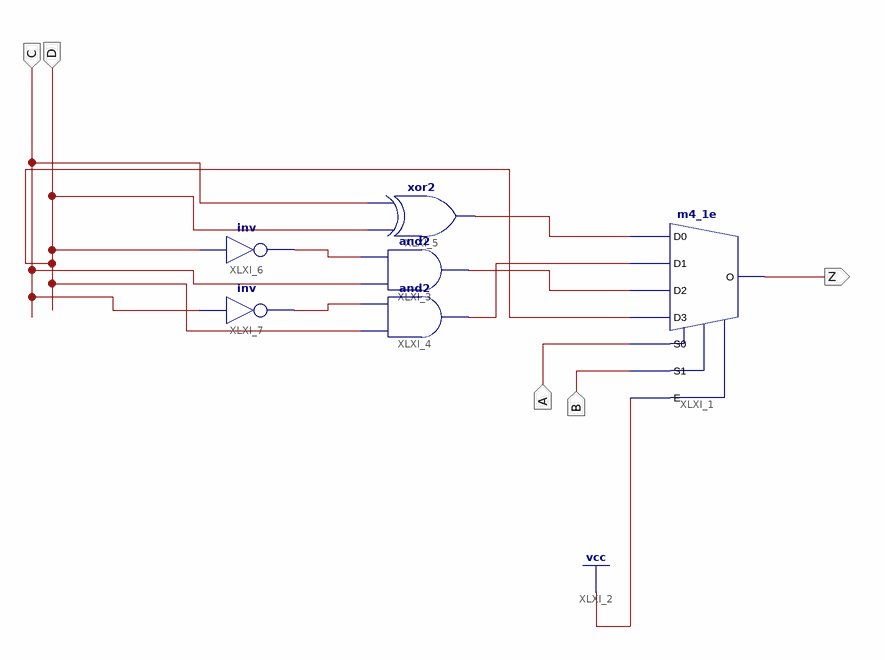
[diagram p0: schematic sheet 1]
// Xilinx ISE schematic p2ej1a.sch (spartan3) as structural Verilog: 6 symbols, 5 ports
module p2ej1a (
  input  A,
  input  B,
  input  C,
  input  D,
  output Z
);

  wire XLXN_1, XLXN_14, XLXN_15, XLXN_16, XLXN_17;

  m4_1e XLXI_1 (.D0(XLXN_1), .D1(XLXN_17), .D2(XLXN_16), .D3(D), .E(1'b1), .S0(A), .S1(B), .O(Z));
  and XLXI_3 (XLXN_16, C, XLXN_14);
  and XLXI_4 (XLXN_17, D, XLXN_15);
  xor XLXI_5 (XLXN_1, D, C);
  not XLXI_6 (XLXN_14, D);
  not XLXI_7 (XLXN_15, C);
endmodule
